# EAGLE design wechselblinkerschaltung (EAGLE 9.2.2)
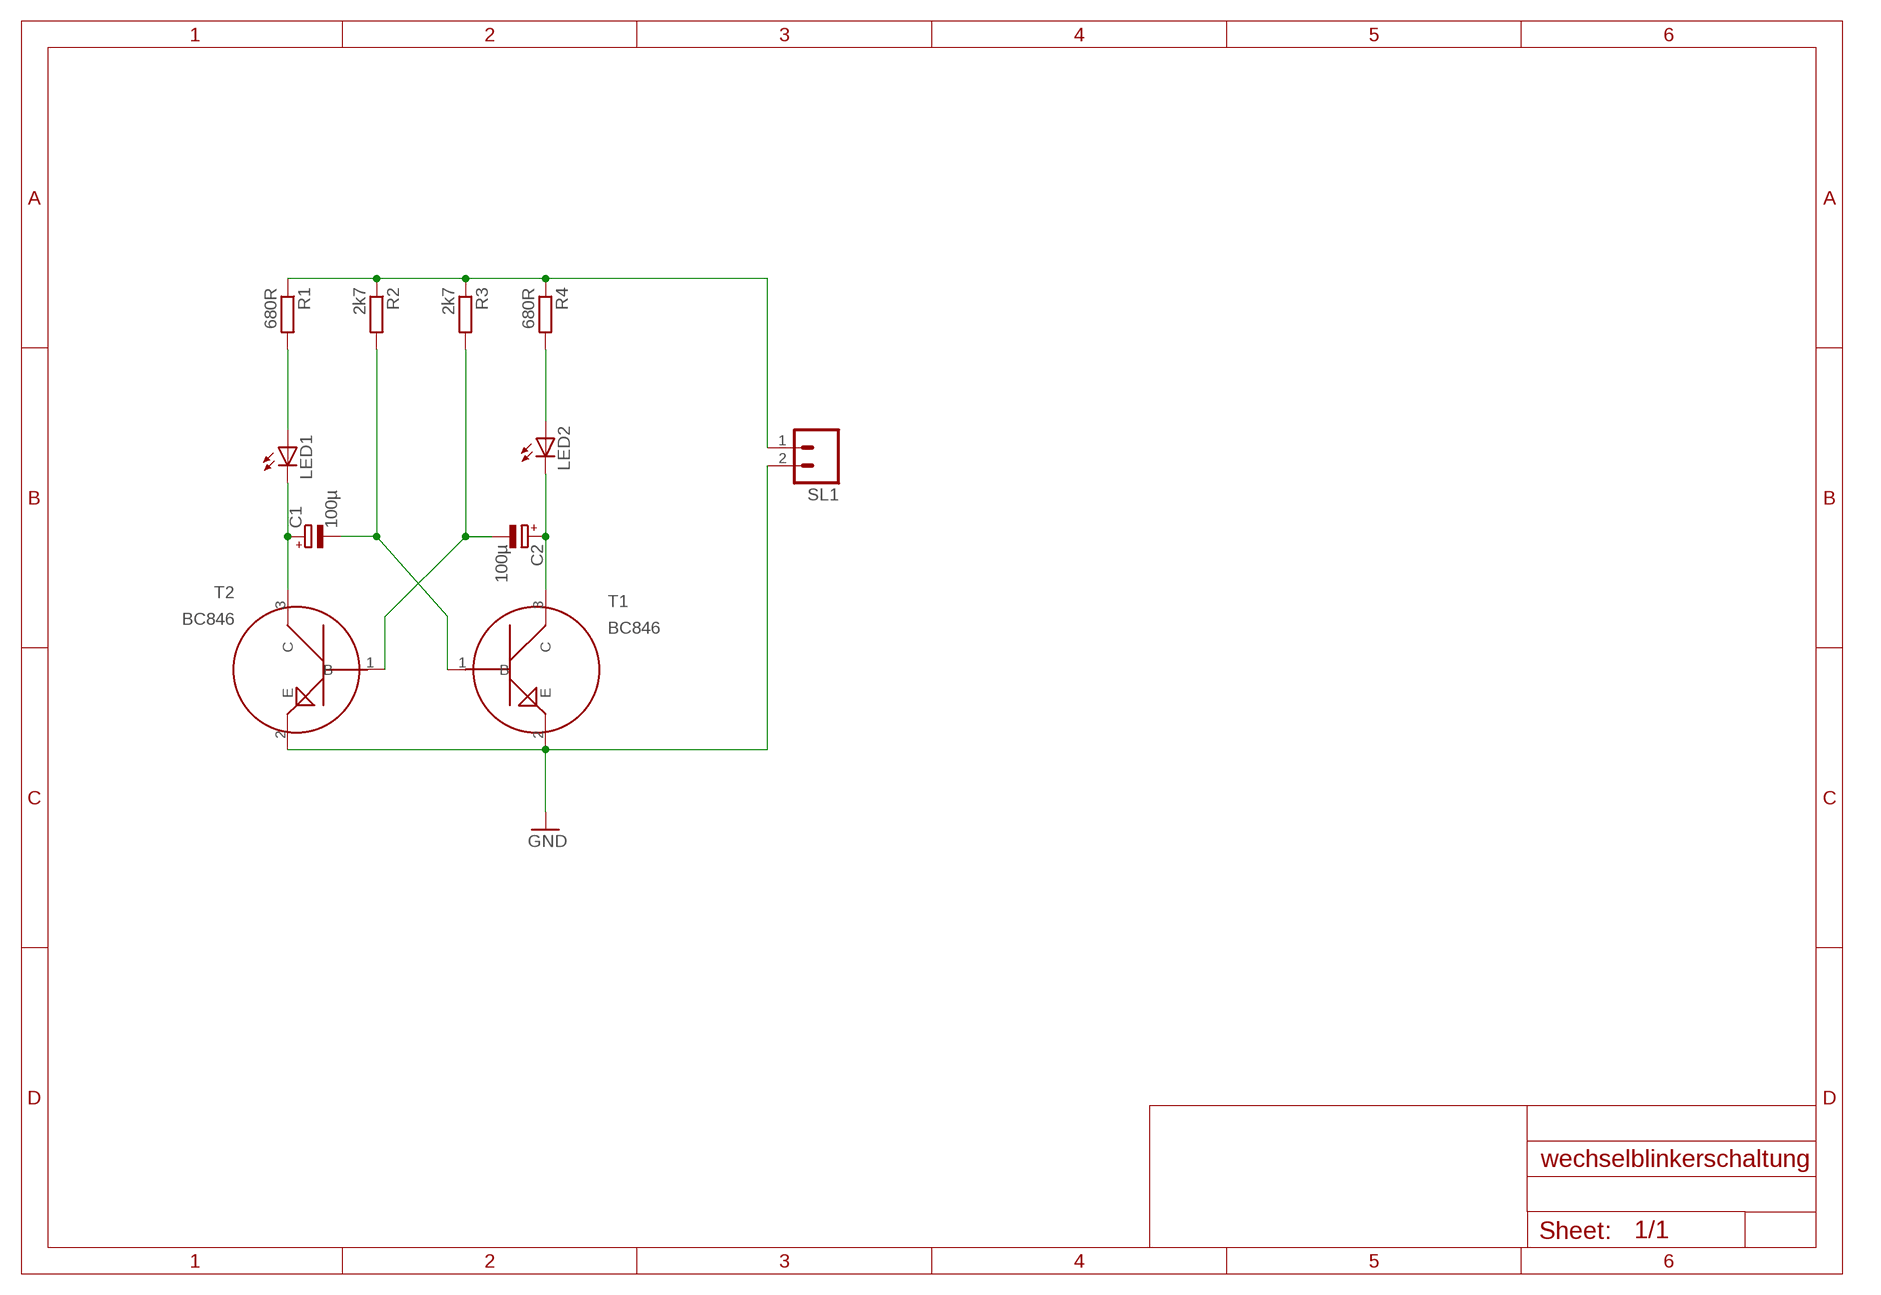
[diagram p0: schematic, sheet 1]

## Parts
C1  100µ  CPOL-EUE2.5-6  [E2,5-6]
C2  100µ  CPOL-EUE2.5-6  [E2,5-6]
LED1  LED5MM  [LED5MM]
LED2  LED5MM  [LED5MM]
R1  680R  R-EU_R0805  [R0805]
R2  2k7  R-EU_R0805  [R0805]
R3  2k7  R-EU_R0805  [R0805]
R4  680R  R-EU_R0805  [R0805]
SL1  M02  [02P]
T1  BC846  [SOT23]
T2  BC846  [SOT23]

## Nets
GND: SL1.2 T1.2(E) T2.2(E)
N$1: R1.1 R2.1 R3.1 R4.1 SL1.1
N$2: LED1.A R1.2
N$3: C1.+ LED1.K(C) T2.3(C)
N$4: LED2.A R4.2
N$5: C2.+ LED2.K(C) T1.3(C)
N$6: C2.- R3.2 T2.1(B)
N$7: C1.- R2.2 T1.1(B)

## Library data of the parts
C1 C2 = rcl:CPOL-EU: POLARIZED CAPACITOR, European symbol; SPICEPREFIX: C
LED1 LED2 = led:LED: LED OSRAM: - CHIPLED LG R971, LG N971, LY N971, LG Q971, LY Q971, LO R971, LY R971 LH N974, LH R974 LS Q976, LO Q976, LY Q976 LO Q996 - Hyper CHIPLED LW Q18S LB Q993, LB Q99A, LB R99A - SideLED LS A670, LO A670, LY A670, LG A670, LP A670 LB A673, LV A673, LT A673, LW A673 LH A674 LY A675 LS A676, LA A676, LO A676, LY A676, LW A676 LS A679, LY A679, LG A679 - Hyper Micro SIDELED® LS Y876, LA Y876, LO Y876, LY Y876 LT Y87S - SmartLED LW L88C, LW L88S LB L89C, LB L89S, LG L890 LS L89K, LO L89K, LY L89K LS L896, LA L896, LO L896, LY L896 - TOPLED LS T670, LO T670, LY T670, LG T670, LP T670 LSG T670, LSP T670, LSY T670, LOP T670, LYG T670 LG T671, LOG T671, LSG T671 LB T673, LV T673, LT T673, LW T673 LH T674 LS T676, LA T676, LO T676, LY T676, LB T676, LH T676, LSB T676, LW T676 LB T67C, LV T67C, LT T67C, LS T67K, LO T67K, LY T67K, LW E67C LS E67B, LA E67B, LO E67B, LY E67B, LB E67C, LV E67C, LT E67C LW T67C LS T679, LY T679, LG T679 LS T770, LO T770, LY T770, LG T770, LP T770 LB T773, LV T773, LT T773, LW T773 LH T774 LS E675, LA E675, LY E675, LS T675 LS T776, LA T776, LO T776, LY T776, LB T776 LHGB T686 LT T68C, LB T68C - Hyper Mini TOPLED® LB M676 - Mini TOPLED Santana® LG M470 LS M47K, LO M47K, LY M47K Source: http://www.osram.convergy.de LUXEON: - LUMILED® LXK2-PW12-R00, LXK2-PW12-S00, LXK2-PW14-U00, LXK2-PW14-V00 LXK2-PM12-R00, LXK2-PM12-S00, LXK2-PM14-U00 LXK2-PE12-Q00, LXK2-PE12-R00, LXK2-PE12-S00, LXK2-PE14-T00, LXK2-PE14-U00 LXK2-PB12-K00, LXK2-PB12-L00, LXK2-PB12-M00, LXK2-PB14-N00, LXK2-PB14-P00, LXK2-PB14-Q00 LXK2-PR12-L00, LXK2-PR12-M00, LXK2-PR14-Q00, LXK2-PR14-R00 LXK2-PD12-Q00, LXK2-PD12-R00, LXK2-PD12-S00 LXK2-PH12-R00, LXK2-PH12-S00 LXK2-PL12-P00, LXK2-PL12-Q00, LXK2-PL12-R00 Source: www.luxeon.com KINGBRIGHT: KA-3528ASYC Source: www.kingbright.com
R1-R4 = rcl:R-EU_: RESISTOR, European symbol; SPICEPREFIX: R
SL1 = con-amp-quick:M02: AMP QUICK CONNECTOR; OC_FARNELL: unknown; OC_NEWARK: unknown
T1 T2 = my_devices:BC846: BC846 / BC847 / BC848 / BC850 NPN Epitaxial Silicon Transistor Features • Switching and Amplifier Applications • Suitable for Automatic Insertion in Thick and Thin-film Circuits • Low Noise: BC850 • Complement to BC856, BC857, BC858, BC859, and BC860

## Board
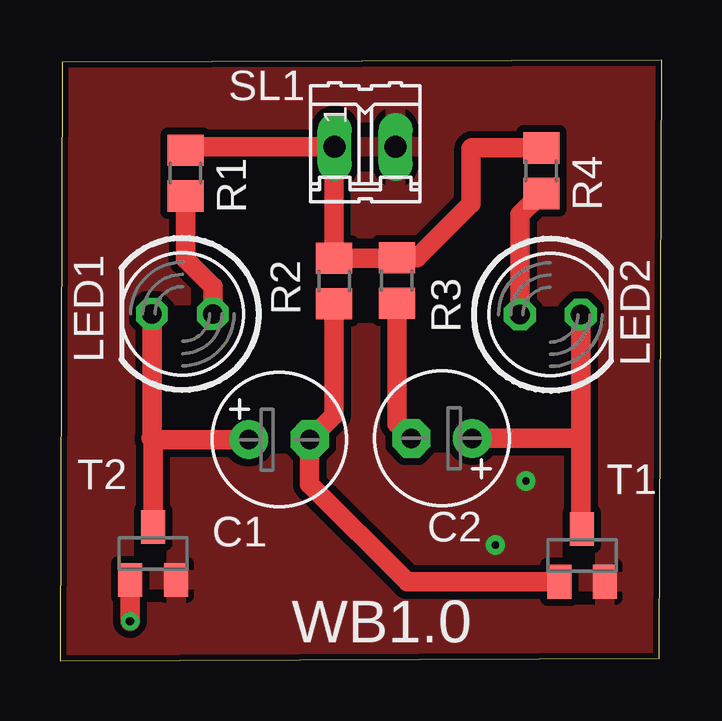
[diagram p1: board, top side]
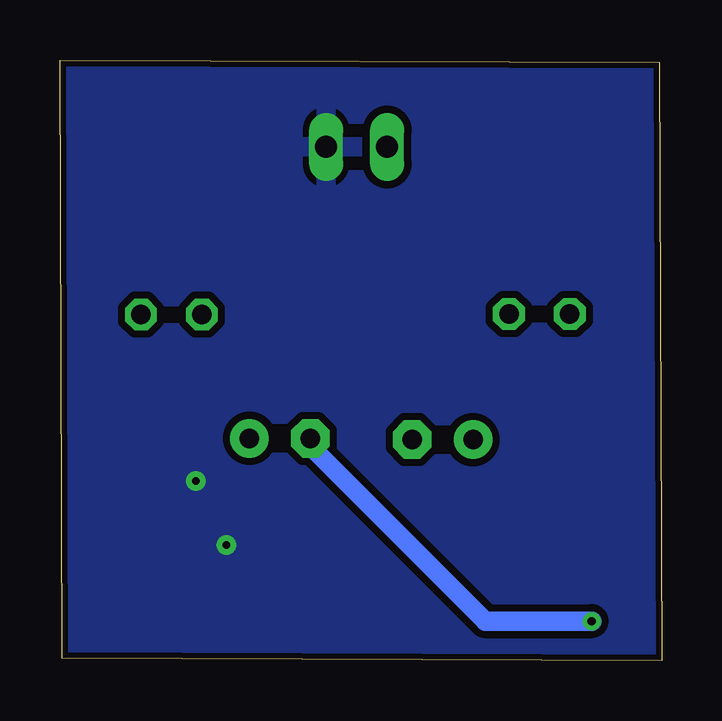
[diagram p2: board, bottom side, seen from below]

Size 25.1 x 25.03 mm. Coordinates in mm from the lower left corner, seen from the top.
Outline: 0,0 24.99,0.1 25.09,25.03 0.1,24.93 0,0
Copper layers (1*16): Top 0.035mm / dielectric 1.5mm / Bottom 0.035mm
Design rules "default *": minimum track width 6mil, minimum drill 0.35mm, track to track 12mil, track to pad 6mil, pad to pad 6mil, via to via 6mil, smd to smd 6mil, copper to edge 10mil, drill to drill 6mil, minimum pad ring 10mil, minimum via ring 8mil, stop-mask expansion 4mil, vias tented up to drill 0mil, thermal gap 10mil

### Footprints (pad centres in the part's own frame; a part is rotated, then mirrored left to right if it is on the bottom)
E2,5-6 = drill 0.813 pad 1.6: + -1.27,0 | drill 0.813 pad 1.6 octagon: - 1.27,0
LED5MM = drill 0.813 octagon: A -1.27,0; K 1.27,0
R0805 = smd 1.3 x 1.5: 1 -0.95,0; 2 0.95,0
02P = drill 0.914 long: 1 -1.27,0; 2 1.27,0
SOT23 = smd 1 x 1.4: 1 -0.95,-1.1; 2 0.95,-1.1; 3 0,1.1

### Placement (x,y rotation side)
C1  9.14,9.22 0 top
C2  15.93,9.27 180 top
LED1  5.11,14.45 180 top
LED2  20.45,14.43 0 top
R1  5.23,20.32 270 top
R2  11.43,15.82 270 top
R3  14.05,15.85 270 top
R4  20.07,20.42 270 top
SL1  12.73,21.41 0 top
T1  21.77,4.39 0 top
T2  3.89,4.47 0 top

### Tracks (layer width: path | path; a pad name or v marks a point on that pad's centre or on a via)
GND  (via drill 0.3 pad 0.8)
  other vias: 18.16,4.83 19.43,7.49
  pour Top: 0.13,24.89 0.13,0 25.02,0 25.02,25.02 0.25,25.02
  pour Bottom: 0.13,24.89 0.13,0.13 24.89,0.13 24.89,24.89
N$1
  Top 0.813: R1.1 5.38,21.41 SL1.1 11.43,21.39 R2.1 14.02,16.77 R3.1 14.89,16.8 17.14,19.05 17.14,21.34 17.18,21.37 R4.1
N$2
  Top 0.813: R1.2 5.23,16.74 6.38,15.6 LED1.A
N$3
  Top 0.813: LED1.K 3.83,9.3 3.81,9.27 3.86,9.22 | 3.86,9.22 C1.+ | T2.3 3.89,9.2 3.86,9.22
N$4
  Top 0.813: R4.2 19.18,18.58 LED2.A
N$5
  Top 0.813: 21.72,9.14 21.72,5.54 T1.3 | LED2.K 21.72,9.14 | C2.+ 21.59,9.27 21.72,9.14
N$6  (via drill 0.35)
  Top 0.813: R3.2 14.05,9.88 C2.- | v2.92,1.65 2.92,3.35 T2.1
  Bottom 0.813: C2.- 14.66,8.94 7.37,1.65 v2.92,1.65
N$7
  Top 0.813: T1.1 14.49,3.29 10.41,7.37 C1.- 11.43,10.24 R2.2

### Text on the board
tNames: WB1.0